# Altium schematic sheet Current_Me.SchDoc
size 229 x 200 mm; SheetNumber: 2; SheetTotal: 12
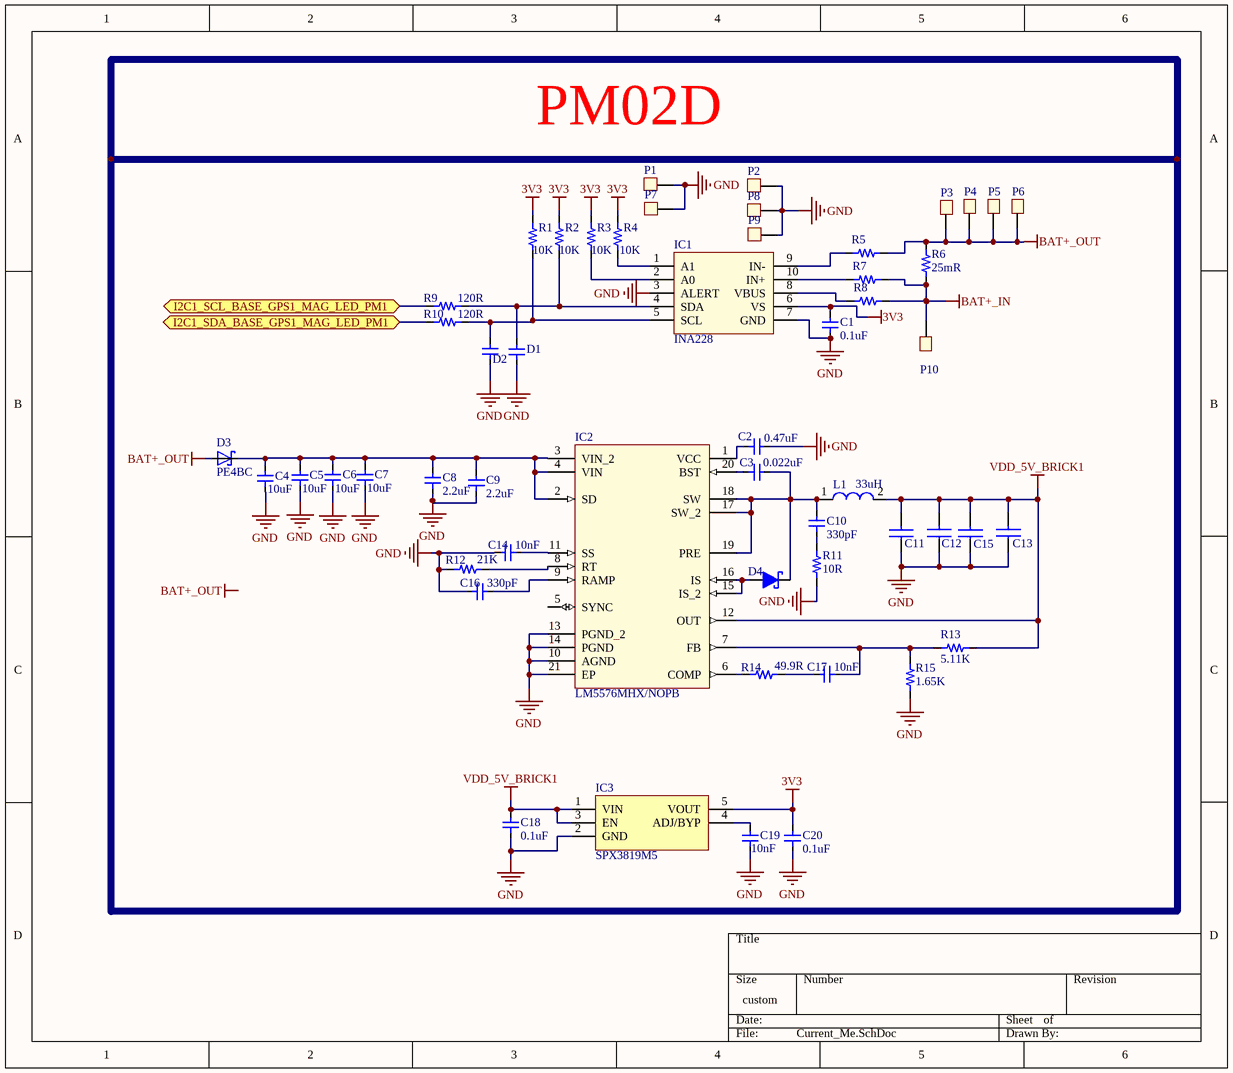
[diagram p0: Current_Me.SchDoc]

## Parts
C1  0.1uF  [C0603]
C2  0.47uF  [C0603]
C3  0.022uF  [C0603]
C4  10uF  [C1206]
C5  10uF  [C1206]
C6  10uF  [C1206]
C7  10uF  [C1206]
C8  2.2uF  [C0603]
C9  2.2uF  [C0603]
C10  330pF  [C0603]
C11  C2012X5R1A226M125AB  [C0805]  (value not drawn)
C12  C2012X5R1A226M125AB  [C0805]  (value not drawn)
C13  C2012X5R1A226M125AB  [C0805]  (value not drawn)
C14  10nF  [C0603]
C15  C2012X5R1A226M125AB  [C0805]  (value not drawn)
C16  330pF  [C0603]
C17  10nF  [C0603]
C18  0.1uF  [C0603]
C19  10nF  [C0603]
C20  0.1uF  [C0603]
D1  PESD0402-140  [PESD0402-140]  (value not drawn)
D2  PESD0402-140  [PESD0402-140]  (value not drawn)
D3  PE4BC  [PE4BC]
D4  MBRS3100T3G  [MBRS3100T3G]  (value not drawn)
IC1  INA228  [VSSOP10]
IC2  LM5576MHX/NOPB  [20HTSSOP]
IC3  SPX3819M5  [SOT23-5]
L1  33uH  [MGAH1005330M-10]
P1  PAD_hàn 5x5  [PAD 5x5]  (value not drawn)
P2  PAD_hàn 5x5  [PAD 5x5]  (value not drawn)
P3  PAD_hàn 5x5  [PAD 5x5]  (value not drawn)
P4  PAD_hàn 5x5  [PAD 5x5]  (value not drawn)
P5  PAD_hàn 5x5  [PAD 5x5]  (value not drawn)
P6  PAD_hàn 5x5  [PAD 5x5]  (value not drawn)
P7  PAD_hàn 5x5  [PAD 5x5]  (value not drawn)
P8  PAD_hàn 5x5  [PAD 5x5]  (value not drawn)
P9  PAD_hàn 5x5  [PAD 5x5]  (value not drawn)
P10  PAD_hàn 5x5  [PAD 5x5]  (value not drawn)
R1  10K  [R0402]
R2  10K  [R0402]
R3  10K  [R0402]
R4  10K  [R0402]
R5  0R/0402  [R0402]  (value not drawn)
R6  25mR  [R2818]
R7  0R/0402  [R0402]  (value not drawn)
R8  0R/0402  [R0402]  (value not drawn)
R9  120R  [R0402]
R10  120R  [R0402]
R11  10R  [R0603]
R12  21K  [R0402]
R13  5.11K  [R0402]
R14  49.9R  [R0402]
R15  1.65K  [R0402]

## Ports
I2C1_SCL_BASE_GPS1_MAG_LED_PM1 (bidir), I2C1_SDA_BASE_GPS1_MAG_LED_PM1 (bidir)

## Nets
3V3: C1.2 C20.2 IC1.6(VS) IC3.5(VOUT) R1.2 R2.2 R3.2 R4.2
BAT+_IN: P10.1 R6.1 R7.2 R8.2
BAT+_OUT: D3.2(A) P3.1 P4.1 P5.1 P6.1 R5.2 R6.2
GND: C1.1 C2.2 C4.1 C5.1 C6.1 C7.1 C8.1 C9.1 C11.1 C12.1 C13.1 C14.2 C15.1 C16.1 C18.1 C19.1 C20.1 D1.1 D2.1 IC1.3(ALERT) IC1.7(GND) IC2.10(AGND) IC2.13(PGND_2) IC2.14(PGND) IC2.21(EP) IC3.2(GND) P1.1 P2.1 P7.1 P8.1 P9.1 R11.1 R12.1 R15.1
VDD_5V_BRICK1: C11.2 C12.2 C13.2 C15.2 C18.2 IC2.12(OUT) IC3.1(VIN) IC3.3(EN) L1.2 R13.2
I2C1_SCL_BASE_GPS1_MAG_LED_PM1: R9.1 ; port I2C1_SCL_BASE_GPS1_MAG_LED_PM1
I2C1_SDA_BASE_GPS1_MAG_LED_PM1: R10.1 ; port I2C1_SDA_BASE_GPS1_MAG_LED_PM1
NetC2_1: C2.1 IC2.1(VCC)
NetC3_1: C3.1 IC2.20(BST)
NetC3_2: C3.2 C10.2 D4.2(K) IC2.17(SW_2) IC2.18(SW) IC2.19(PRE) L1.1
NetC4_2: C4.2 C5.2 C6.2 C7.2 C8.2 C9.2 D3.1(C) IC2.2(SD) IC2.3(VIN_2) IC2.4(VIN)
NetC10_1: C10.1 R11.2
NetC14_1: C14.1 IC2.11(SS)
NetC16_2: C16.2 IC2.9(RAMP)
NetC17_1: C17.1 IC2.7(FB) R13.1 R15.2
NetC17_2: C17.2 R14.2
NetC19_2: C19.2 IC3.4(ADJ/BYP)
NetD1_2: D1.2 IC1.4(SDA) R2.1 R9.2
NetD2_2: D2.2 IC1.5(SCL) R1.1 R10.2
NetD4_1: D4.1(A) IC2.15(IS_2) IC2.16(IS)
NetIC1_1: IC1.1(A1) R4.1
NetIC1_2: IC1.2(A0) R3.1
NetIC1_8: IC1.8(VBUS) R8.1
NetIC1_9: IC1.9(IN-) R5.1
NetIC1_10: IC1.10(IN+) R7.1
NetIC2_6: IC2.6(COMP) R14.1
NetIC2_8: IC2.8(RT) R12.2

Not connected (* = marked no-connect by the designer): IC2 5(SYNC)

## Notes on the sheet
- PM02D
- Labels drawn without touching a wire or pin: BAT+_OUT

## Library data of the parts
C1 C18 C20 = CC0603KRX7R8BB104: CAP CER 0.1UF 25V X7R 0603
C2 = CC0603KRX5R9BB474: 0.47 µF ±10% 50V Ceramic Capacitor X5R 0603 (1608 Metric)
C3 = 0603B223K500CT: 0.022 µF ±10% 50V Ceramic Capacitor X7R 0603 (1608 Metric)
C4-C7 = C3216X6S2A106K160AC: 10 µF ±10% 100V Ceramic Capacitor X6S 1206 (3216 Metric)
C8 C9 = CC0603KPX5R6BB225: 2.2 µF ±10% 10V Ceramic Capacitor X5R 0603 (1608 Metric)
C10 C16 = CC0603KRX7R8BB331: 330 pF ±10% 25V Ceramic Capacitor X7R 0603 (1608 Metric)
C11-C13 C15 = C2012X5R1A226M125AB: Multilayer Ceramic Capacitors MLCC - SMD/SMT 0805 10V 22uF X5R 20% T: 1.25mm
C14 C17 C19 = CC0603JRX7R8BB103: 10000 pF ±5% 25V Ceramic Capacitor X7R 0603 (1608 Metric)
D1 D2 = PESD0402-140: 40V Clamp - Ipp Tvs Diode Surface Mount 0402
D3 = PE4BC: Diode 100 V 4A Surface Mount DO-214AB (SMC)
D4 = MBRS3100T3G: DIODE SCHOTTKY 100V 3A SMC
IC1 = INA228AQDGSRQ1: Current & Power Monitors & Regulators AEC-Q100 85-V 20-b it ultraprecise I
IC2 = LM5576MHX/NOPB: IC REG BUCK ADJ 3A 20HTSSOP
IC3 = SPX3819M5-L-3-0/TR: IC REG LINEAR 3V 500MA SOT23-5
L1 = MGAH1005330M-10: Power Inductors - SMD 33uH 0.075ohm 5A
R1-R4 = RC1005F103CS: RES SMD 10K OHM 1% 1/16W 0402
R5 R7 R8 = CR0402AJ/-000GAS: 0 Ohms Jumper Chip Resistor 0402 (1005 Metric) Anti-Sulfur, Automotive AEC-Q200, Moisture Resistant Thick Film
R6 = WSHP2818R0250FEA: / 25 mOhms ±1% 10W Chip Resistor Nonstandard Automotive AEC-Q200, Current Sense, Moisture Resistant, Pulse Withstanding Metal Element
R9 R10 = RC0402FR-07120RL: 120 Ohms ±1% 0.063W, 1/16W Chip Resistor 0402 (1005 Metric) Moisture Resistant Thick Film
R11 = RMCF0603FT10R0: 10 Ohms ±1% 0.1W, 1/10W Chip Resistor 0603 (1608 Metric) Automotive AEC-Q200 Thick Film
R12 = RC0402FR-0721KL: / 21 kOhms ±1% 0.063W, 1/16W Chip Resistor 0402 (1005 Metric) Moisture Resistant Thick Film
R13 = ERJ-2RKF5111X: 5.11 kOhms ±1% 0.1W, 1/10W Chip Resistor 0402 (1005 Metric) Automotive AEC-Q200 Thick Film
R14 = CRT0402ABY-49R9GLF: 49.9 kOhms ±0.1% 0.063W, 1/16W Chip Resistor 0402 (1005 Metric) Anti-Sulfur, Automotive AEC-Q200 Thin Film
R15 = RC0402FR-071K65L: RES 1.65K OHM 1% 1/16W 0402